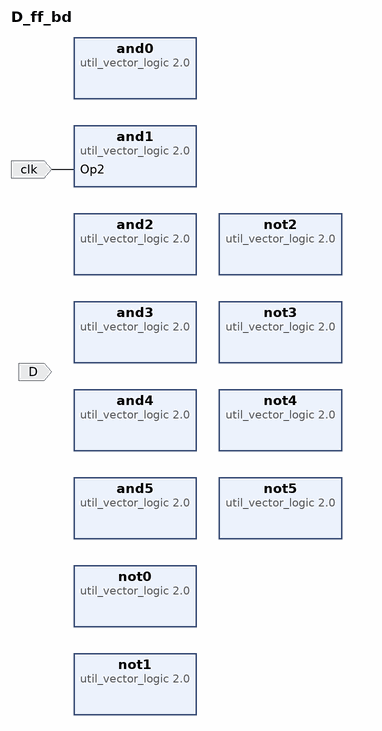
[diagram p0: block diagram of the top level]
# Vivado block design D_ff_bd, xc7a100tfgg484-1, Vivado 2017.4
create_bd_design D_ff_bd

create_bd_port -dir I clk
create_bd_port -dir I D

create_bd_cell -type ip -vlnv xilinx.com:ip:util_vector_logic:2.0 and0
set_property -dict {CONFIG.C_SIZE 1} [get_bd_cells and0]
create_bd_cell -type ip -vlnv xilinx.com:ip:util_vector_logic:2.0 and1
set_property -dict {CONFIG.C_SIZE 1} [get_bd_cells and1]
create_bd_cell -type ip -vlnv xilinx.com:ip:util_vector_logic:2.0 and2
set_property -dict {CONFIG.C_SIZE 1} [get_bd_cells and2]
create_bd_cell -type ip -vlnv xilinx.com:ip:util_vector_logic:2.0 and3
set_property -dict {CONFIG.C_SIZE 1} [get_bd_cells and3]
create_bd_cell -type ip -vlnv xilinx.com:ip:util_vector_logic:2.0 and4
set_property -dict {CONFIG.C_SIZE 1} [get_bd_cells and4]
create_bd_cell -type ip -vlnv xilinx.com:ip:util_vector_logic:2.0 and5
set_property -dict {CONFIG.C_SIZE 1} [get_bd_cells and5]
create_bd_cell -type ip -vlnv xilinx.com:ip:util_vector_logic:2.0 not0
set_property -dict {CONFIG.C_SIZE 1 CONFIG.C_OPERATION not} [get_bd_cells not0]
create_bd_cell -type ip -vlnv xilinx.com:ip:util_vector_logic:2.0 not1
set_property -dict {CONFIG.C_SIZE 1 CONFIG.C_OPERATION not} [get_bd_cells not1]
create_bd_cell -type ip -vlnv xilinx.com:ip:util_vector_logic:2.0 not2
set_property -dict {CONFIG.C_SIZE 1 CONFIG.C_OPERATION not} [get_bd_cells not2]
create_bd_cell -type ip -vlnv xilinx.com:ip:util_vector_logic:2.0 not3
set_property -dict {CONFIG.C_SIZE 1 CONFIG.C_OPERATION not} [get_bd_cells not3]
create_bd_cell -type ip -vlnv xilinx.com:ip:util_vector_logic:2.0 not4
set_property -dict {CONFIG.C_SIZE 1 CONFIG.C_OPERATION not} [get_bd_cells not4]
create_bd_cell -type ip -vlnv xilinx.com:ip:util_vector_logic:2.0 not5
set_property -dict {CONFIG.C_SIZE 1 CONFIG.C_OPERATION not} [get_bd_cells not5]

# ---- connections ----

connect_bd_net [get_bd_ports clk] [get_bd_pins and1/Op2]

validate_bd_design
save_bd_design
